# Altium schematic sheet Communications_Chip.SchDoc
size A; SheetNumber: 4; SheetTotal: 5
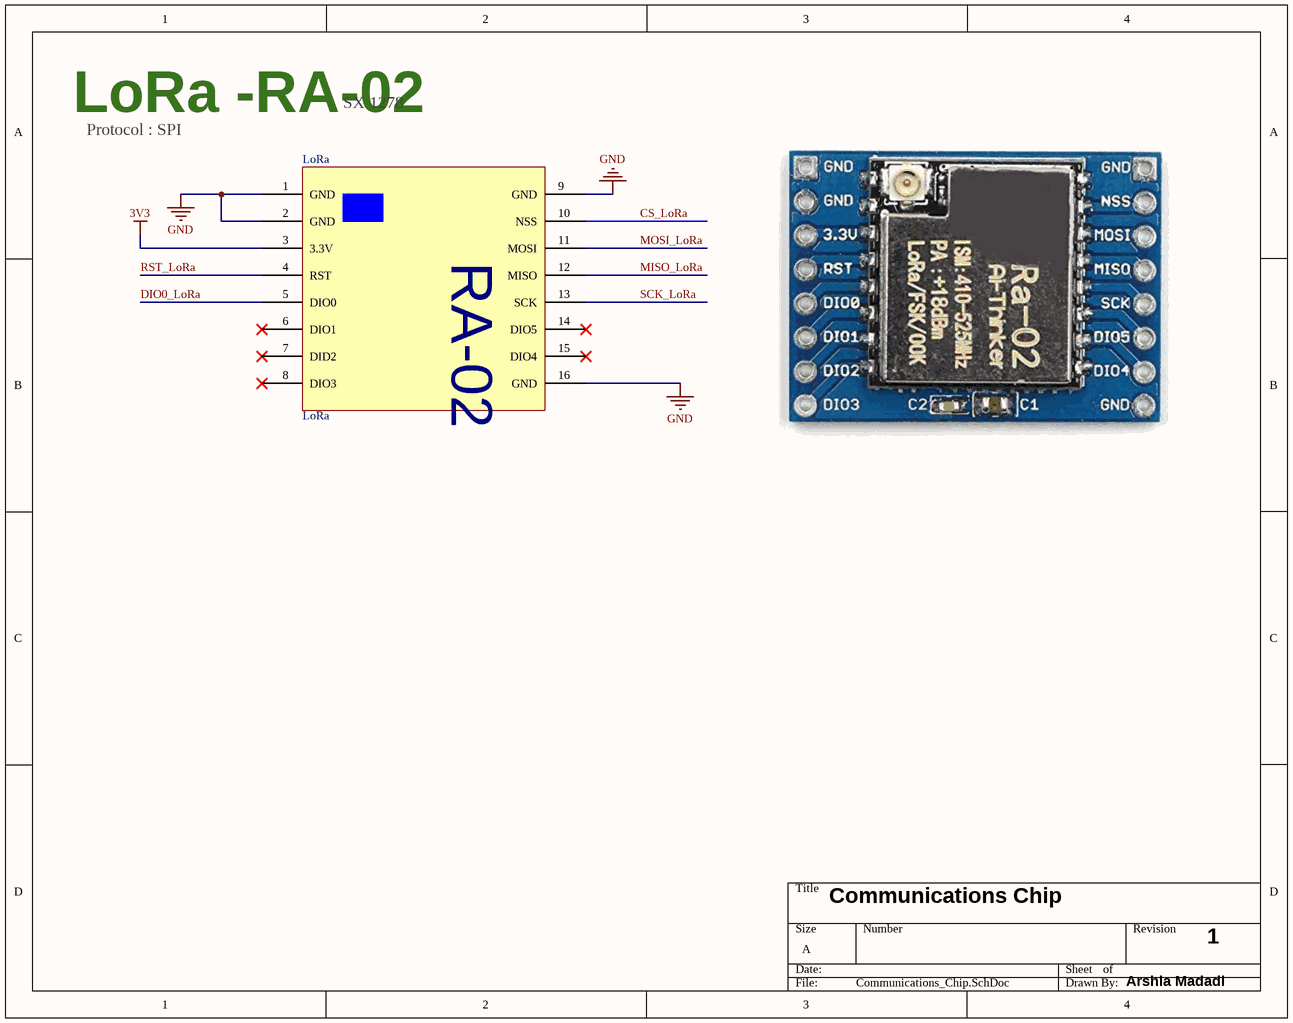
[diagram p0: Communications_Chip.SchDoc]

## Parts
LoRa  LoRa  [PCBComponent_1]

## Nets
3V3: LoRa.3(3.3V)
GND: LoRa.1(GND) LoRa.2(GND) LoRa.9(GND) LoRa.16(GND)
CS_LoRa: LoRa.10(NSS)
DIO0_LoRa: LoRa.5(DIO0)
MISO_LoRa: LoRa.12(MISO)
MOSI_LoRa: LoRa.11(MOSI)
RST_LoRa: LoRa.4(RST)
SCK_LoRa: LoRa.13(SCK)

Not connected (* = marked no-connect by the designer): LoRa 6(DIO1)* 7(DID2)* 8(DIO3)* 14(DIO5)* 15(DIO4)*

## Notes on the sheet
- LoRa -RA-02
- Protocol : SPI
- SX 1278
- Communications Chip
- 1
- Arshia Madadi
- (in symbol LoRa) RA-02